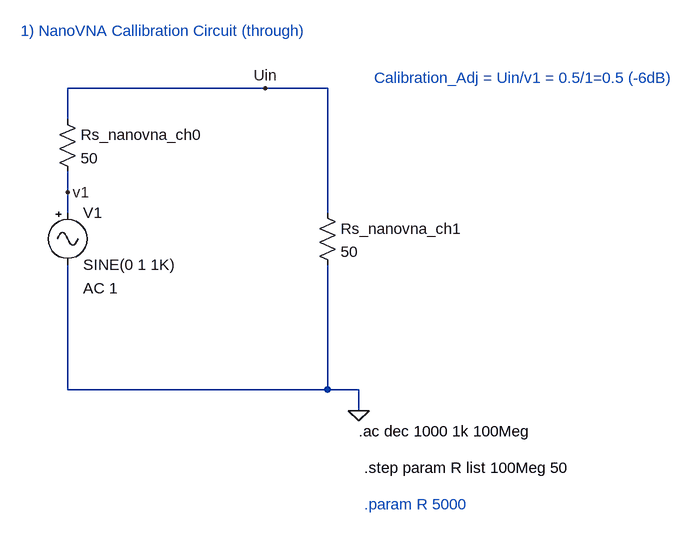
[diagram p0: schematic RFTap_v1_calibration_circuit.asc]
RFTap_v1_calibration_circuit.asc, the LTspice schematic file:
Version 4
SHEET 1 1764 1784
WIRE -3152 416 -3456 416
WIRE -3056 416 -3152 416
WIRE -3456 464 -3456 416
WIRE -3456 576 -3456 544
WIRE -3456 608 -3456 576
WIRE -3056 608 -3056 416
WIRE -3456 880 -3456 688
WIRE -3056 880 -3056 688
WIRE -3056 880 -3456 880
WIRE -3008 880 -3056 880
WIRE -3008 912 -3008 880
FLAG -3008 912 0
FLAG -3456 576 v1
FLAG -3152 416 Uin
SYMBOL Misc\\signal -3456 592 R0
WINDOW 123 24 132 Left 2
WINDOW 39 24 160 Left 2
SYMATTR InstName V1
SYMATTR Value2 AC 1
SYMBOL res -3072 592 R0
SYMATTR InstName Rs_nanovna_ch1
SYMATTR Value 50
SYMBOL res -3472 448 R0
SYMATTR InstName Rs_nanovna_ch0
SYMATTR Value 50
TEXT -3008 944 Left 2 !.ac dec 1000 1k 100Meg
TEXT -3000 1000 Left 2 !.step param R list 100Meg 50
TEXT -3000 1056 Left 2 ;.param R 5000
TEXT -3528 328 Left 2 ;1) NanoVNA Callibration Circuit (through)
TEXT -2984 400 Left 2 ;Calibration_Adj = Uin/v1 = 0.5/1=0.5 (-6dB)

The netlist it stands for:
* RFTap_v1_calibration_circuit.asc
V1 v1 0 SINE(0 1 1K) AC 1
Rs_nanovna_ch1 Uin 0 50
Rs_nanovna_ch0 Uin v1 50
.ac dec 1000 1k 100Meg
.step param R list 100Meg 50
* .param R 5000
* 1) NanoVNA Callibration Circuit (through)
* Calibration_Adj = Uin/v1 = 0.5/1=0.5 (-6dB)
.backanno
.end